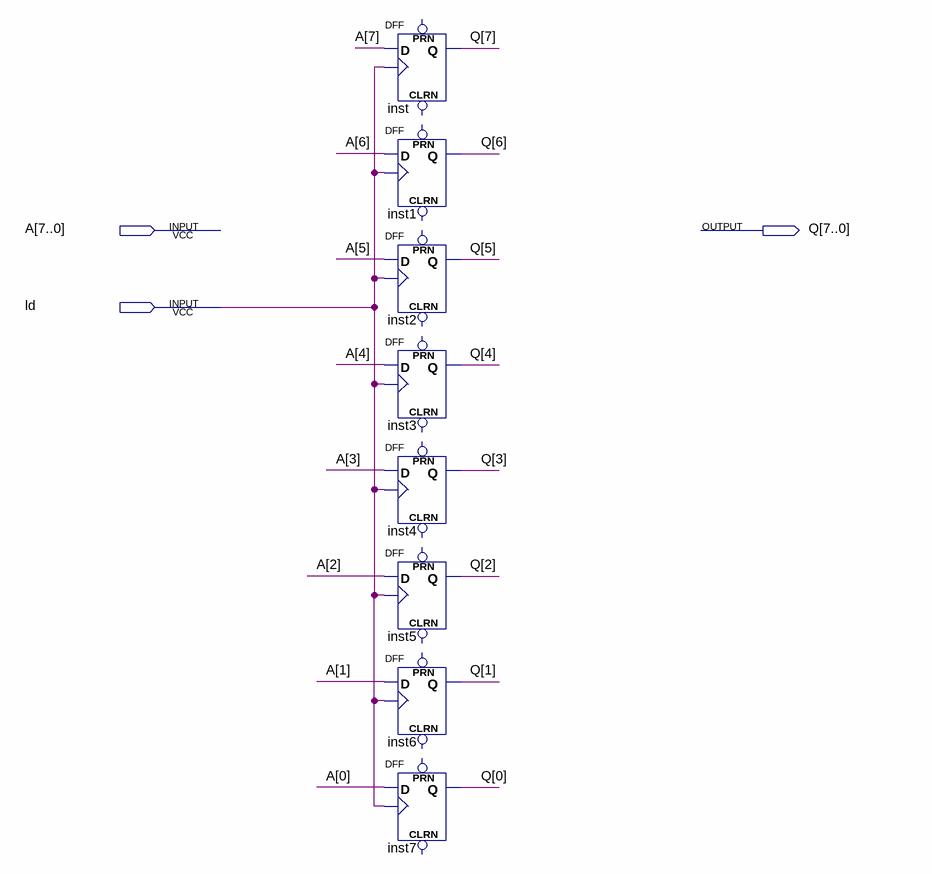
[diagram p0: schematic sheet]
// Quartus schematic REG8.bdf as structural Verilog: 8 symbols, 3 pins
module REG8 (
  input  [7:0] A,
  input  ld,
  output [7:0] Q
);

  DFF inst (.CLK(ld), .D(A[7]), .Q(Q[7]));  // open: CLRN, PRN
  DFF inst1 (.CLK(ld), .D(A[6]), .Q(Q[6]));  // open: CLRN, PRN
  DFF inst2 (.CLK(ld), .D(A[5]), .Q(Q[5]));  // open: CLRN, PRN
  DFF inst3 (.CLK(ld), .D(A[4]), .Q(Q[4]));  // open: CLRN, PRN
  DFF inst4 (.CLK(ld), .D(A[3]), .Q(Q[3]));  // open: CLRN, PRN
  DFF inst5 (.CLK(ld), .D(A[2]), .Q(Q[2]));  // open: CLRN, PRN
  DFF inst6 (.CLK(ld), .D(A[1]), .Q(Q[1]));  // open: CLRN, PRN
  DFF inst7 (.CLK(ld), .D(A[0]), .Q(Q[0]));  // open: CLRN, PRN
endmodule
